# Altium schematic sheet SD_CARD.SchDoc
size A; SheetNumber: 7; SheetTotal: 9
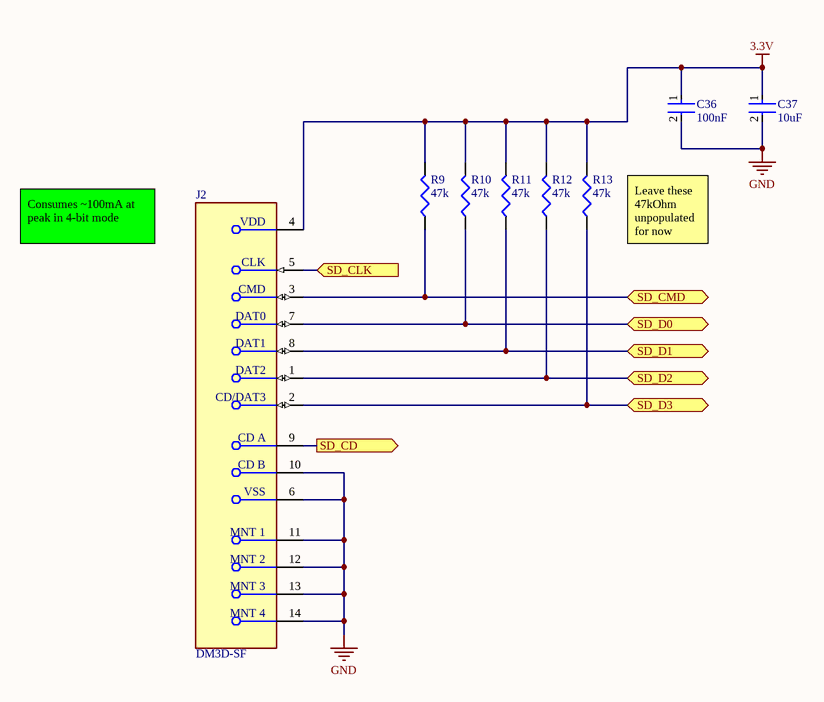
[diagram p0: SD_CARD.SchDoc]

## Parts
C36  100nF  [FP-C0603C-CF-MFG]
C37  10uF  [FP-C0603C-CF-MFG]
J2  DM3D-SF  [FP-DM3D-SF-MFG]
R9  47k  [J1-0603]
R10  47k  [J1-0603]
R11  47k  [J1-0603]
R12  47k  [J1-0603]
R13  47k  [J1-0603]

## Ports
SD_CD (out), SD_CLK (in), SD_CMD (bidir), SD_D0 (bidir), SD_D1 (bidir), SD_D2 (bidir), SD_D3 (bidir)

## Nets
3.3V: C36.1 C37.1 J2.4(VDD) R9.2 R10.2 R11.2 R12.2 R13.2
GND: C36.2 C37.2 J2.6(VSS) J2.10(CD_B) J2.11(MNT_1) J2.12(MNT_2) J2.13(MNT_3) J2.14(MNT_4)
SD_CD: J2.9(CD_A) ; port SD_CD
SD_CLK: J2.5(CLK) ; port SD_CLK
SD_CMD: J2.3(CMD) R9.1 ; port SD_CMD
SD_D0: J2.7(DAT0) R10.1 ; port SD_D0
SD_D1: J2.8(DAT1) R11.1 ; port SD_D1
SD_D2: J2.1(DAT2) R12.1 ; port SD_D2
SD_D3: J2.2(CD/DAT3) R13.1 ; port SD_D3

## Notes on the sheet
- Consumes ~100mA at peak in 4-bit mode
- Leave these 47kOhm unpopulated for now

## Library data of the parts
C36 C37 = CMP-2006-03061-2: Any 0603 Cap is fine here; Manufacturer: KEMET; Manufacturer Part Number: C0603C104K5RACTU; Tolerance: 0.1; Temperature Coefficient: 30ppm/°C; Material: Ceramic; Automotive Grade: Grade 1; Voltage Rating: 50 V; Value: 0.10 μF; Temperature Characteristic: X7R; Temperature: -55°C to +125°C; RoHS: TRUE; Temperature Range High: +125°C; Lead Free: Yes; Octopart: https://octopart.com/c0603c104k5ractu-kemet-139244; Digikey Description: CAP CER 0.1UF 50V X7R 0603; Category: Cap; Package: C0603C-CF; ComponentLink2Description: Datasheet; Temperature Range Low: -55°C; Device Class L1: Passive Components; Automotive: Yes; Device Class L3: Ceramic Capacitors; ComponentLink2URL: https://api.kemet.com/component-edge/download/datasheet/C0603C100J5GACAUTO.pdf; Capacitance: 0.10 μF; Device Class L2: Capacitors; Height: 0.87mm
J2 = CMP-2000-06166-2: CONN MICRO SD CARD PUSH-PULL; Insulation Resistance: 1GR; Max Voltage Rating (AC): 125V; Gender: Female; Contact Resistance: 100mR; Current Rating: 500mA; Pitch: 1.1mm; Connector Type: Connector; Number of Contacts: 8; Contact Plating: Gold; Number of Rows: 1; Termination: Solder; Contact Material: Copper Alloy; REACH SVHC: No SVHC; Voltage Rating (AC): 125V; Packaging: Tape and Reel; Housing Material: Polymer; Max Operating Temperature: 85°C; Package Quantity: 1; Min Operating Temperature: -25°C; Lead Free: Lead Free; Orientation: Right Angle; Radiation Hardening: No; Flammability Rating: UL94 V-0; Mount: Surface Mount; Depth: 11.45mm; Max Current Rating: 500mA; Length: 11.95mm; Width: 11.95mm
R9-R13 = Res3: Resistor; Published: 8-Jun-2000; LatestRevisionDate: 29-May-2009; LatestRevisionNote: IPC-7351 Footprint Added.; PackageReference: J1-0603; Publisher: Altium Limited; PackageDescription: Chip Resistor; Value: 47K